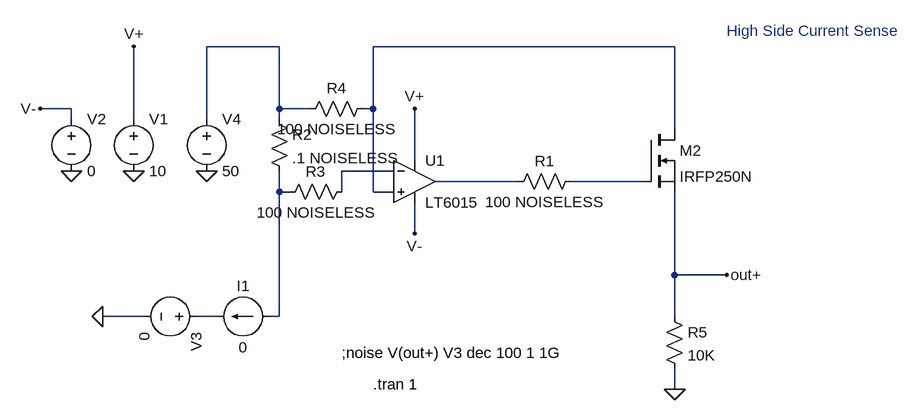
[diagram p0: schematic HSCS_OTT_LT6015.asc]
HSCS_OTT_LT6015.asc, the LTspice schematic file:
Version 4
SHEET 1 1284 680
WIRE -128 48 -240 48
WIRE 480 48 16 48
WIRE -448 144 -496 144
WIRE -128 144 -128 48
WIRE -80 144 -128 144
WIRE 16 144 16 48
WIRE 16 144 0 144
WIRE -448 160 -448 144
WIRE -352 160 -352 48
WIRE -240 160 -240 48
WIRE -128 160 -128 144
WIRE 480 176 480 48
WIRE 80 224 80 144
WIRE 48 240 -32 240
WIRE 240 256 112 256
WIRE 432 256 320 256
WIRE -128 272 -128 240
WIRE -112 272 -128 272
WIRE -32 272 -32 240
WIRE 16 272 16 144
WIRE 48 272 16 272
WIRE 80 336 80 288
WIRE 480 400 480 272
WIRE 560 400 480 400
WIRE -336 464 -400 464
WIRE -224 464 -256 464
WIRE -128 464 -128 272
WIRE -128 464 -144 464
WIRE 480 464 480 400
WIRE 480 576 480 544
FLAG -352 240 0
FLAG 560 400 out+
FLAG -448 240 0
FLAG -496 144 V-
FLAG 80 336 V-
FLAG -400 464 0
FLAG -352 48 V+
FLAG 80 144 V+
FLAG 480 576 0
FLAG -240 240 0
SYMBOL voltage -352 144 R0
WINDOW 123 0 0 Left 0
WINDOW 39 0 0 Left 0
SYMATTR InstName V1
SYMATTR Value 10
SYMBOL voltage -448 144 R0
WINDOW 123 0 0 Left 0
WINDOW 39 0 0 Left 0
SYMATTR InstName V2
SYMATTR Value 0
SYMBOL Opamps\\LT6015 80 256 R0
SYMATTR InstName U1
SYMBOL current -144 464 R90
WINDOW 0 -32 40 VBottom 2
WINDOW 3 32 40 VTop 2
WINDOW 123 0 0 Left 0
WINDOW 39 0 0 Left 0
SYMATTR InstName I1
SYMATTR Value 0
SYMBOL res -144 144 R0
SYMATTR InstName R2
SYMATTR Value .1 NOISELESS
SYMBOL res -128 288 R270
WINDOW 0 32 56 VTop 2
WINDOW 3 0 56 VBottom 2
SYMATTR InstName R3
SYMATTR Value 100 NOISELESS
SYMBOL res -96 160 R270
WINDOW 0 32 56 VTop 2
WINDOW 3 0 56 VBottom 2
SYMATTR InstName R4
SYMATTR Value 100 NOISELESS
SYMBOL res 336 240 R90
WINDOW 0 0 56 VBottom 2
WINDOW 3 32 56 VTop 2
SYMATTR InstName R1
SYMATTR Value 100 NOISELESS
SYMBOL res 464 448 R0
SYMATTR InstName R5
SYMATTR Value 10K
SYMBOL voltage -240 464 R90
WINDOW 123 0 0 Left 0
WINDOW 39 0 0 Left 0
SYMATTR InstName V3
SYMATTR Value 0
SYMBOL voltage -240 144 R0
WINDOW 123 0 0 Left 0
WINDOW 39 0 0 Left 0
SYMATTR InstName V4
SYMATTR Value 50
SYMBOL nmos 432 176 R0
SYMATTR InstName M2
SYMATTR Value IRFP250N
TEXT 560 24 Left 2 ;High Side Current Sense
TEXT -32 520 Left 2 !;noise V(out+) V3 dec 100 1 1G
TEXT 16 568 Left 2 !.tran 1

The netlist it stands for:
* HSCS_OTT_LT6015.asc
V1 V+ 0 10
V2 V- 0 0
XU1 N002 N003 V+ V- N004 LT6016  ; LT6015, pins In+ In- V+ V- OUT
I1 N006 N007 0
R2 N001 N006 .1 NOISELESS
R3 N006 N003 100 NOISELESS
R4 N001 N002 100 NOISELESS
R1 N005 N004 100 NOISELESS
R5 out+ 0 10K
V3 N007 0 0
V4 N001 0 50
M2 N002 N005 out+ out+ IRFP250N
.model NMOS NMOS
.model PMOS PMOS
.lib standard.mos
* High Side Current Sense
;noise V(out+) V3 dec 100 1 1G
.tran 1
.lib LTC2.lib
.backanno
.end